# Altium schematic sheet FPGA_Memec_Spartan3_SxLC_Rev1.SchDoc: Example for Memec Spartan3 SxLC Rev1
size B; SheetNumber: 1; SheetTotal: 1; Address1: L3, 12a Rodborough Rd; Address2: Frenchs Forest; Address3: NSW; Address4: Australia 2086; Organization: Altium Limited
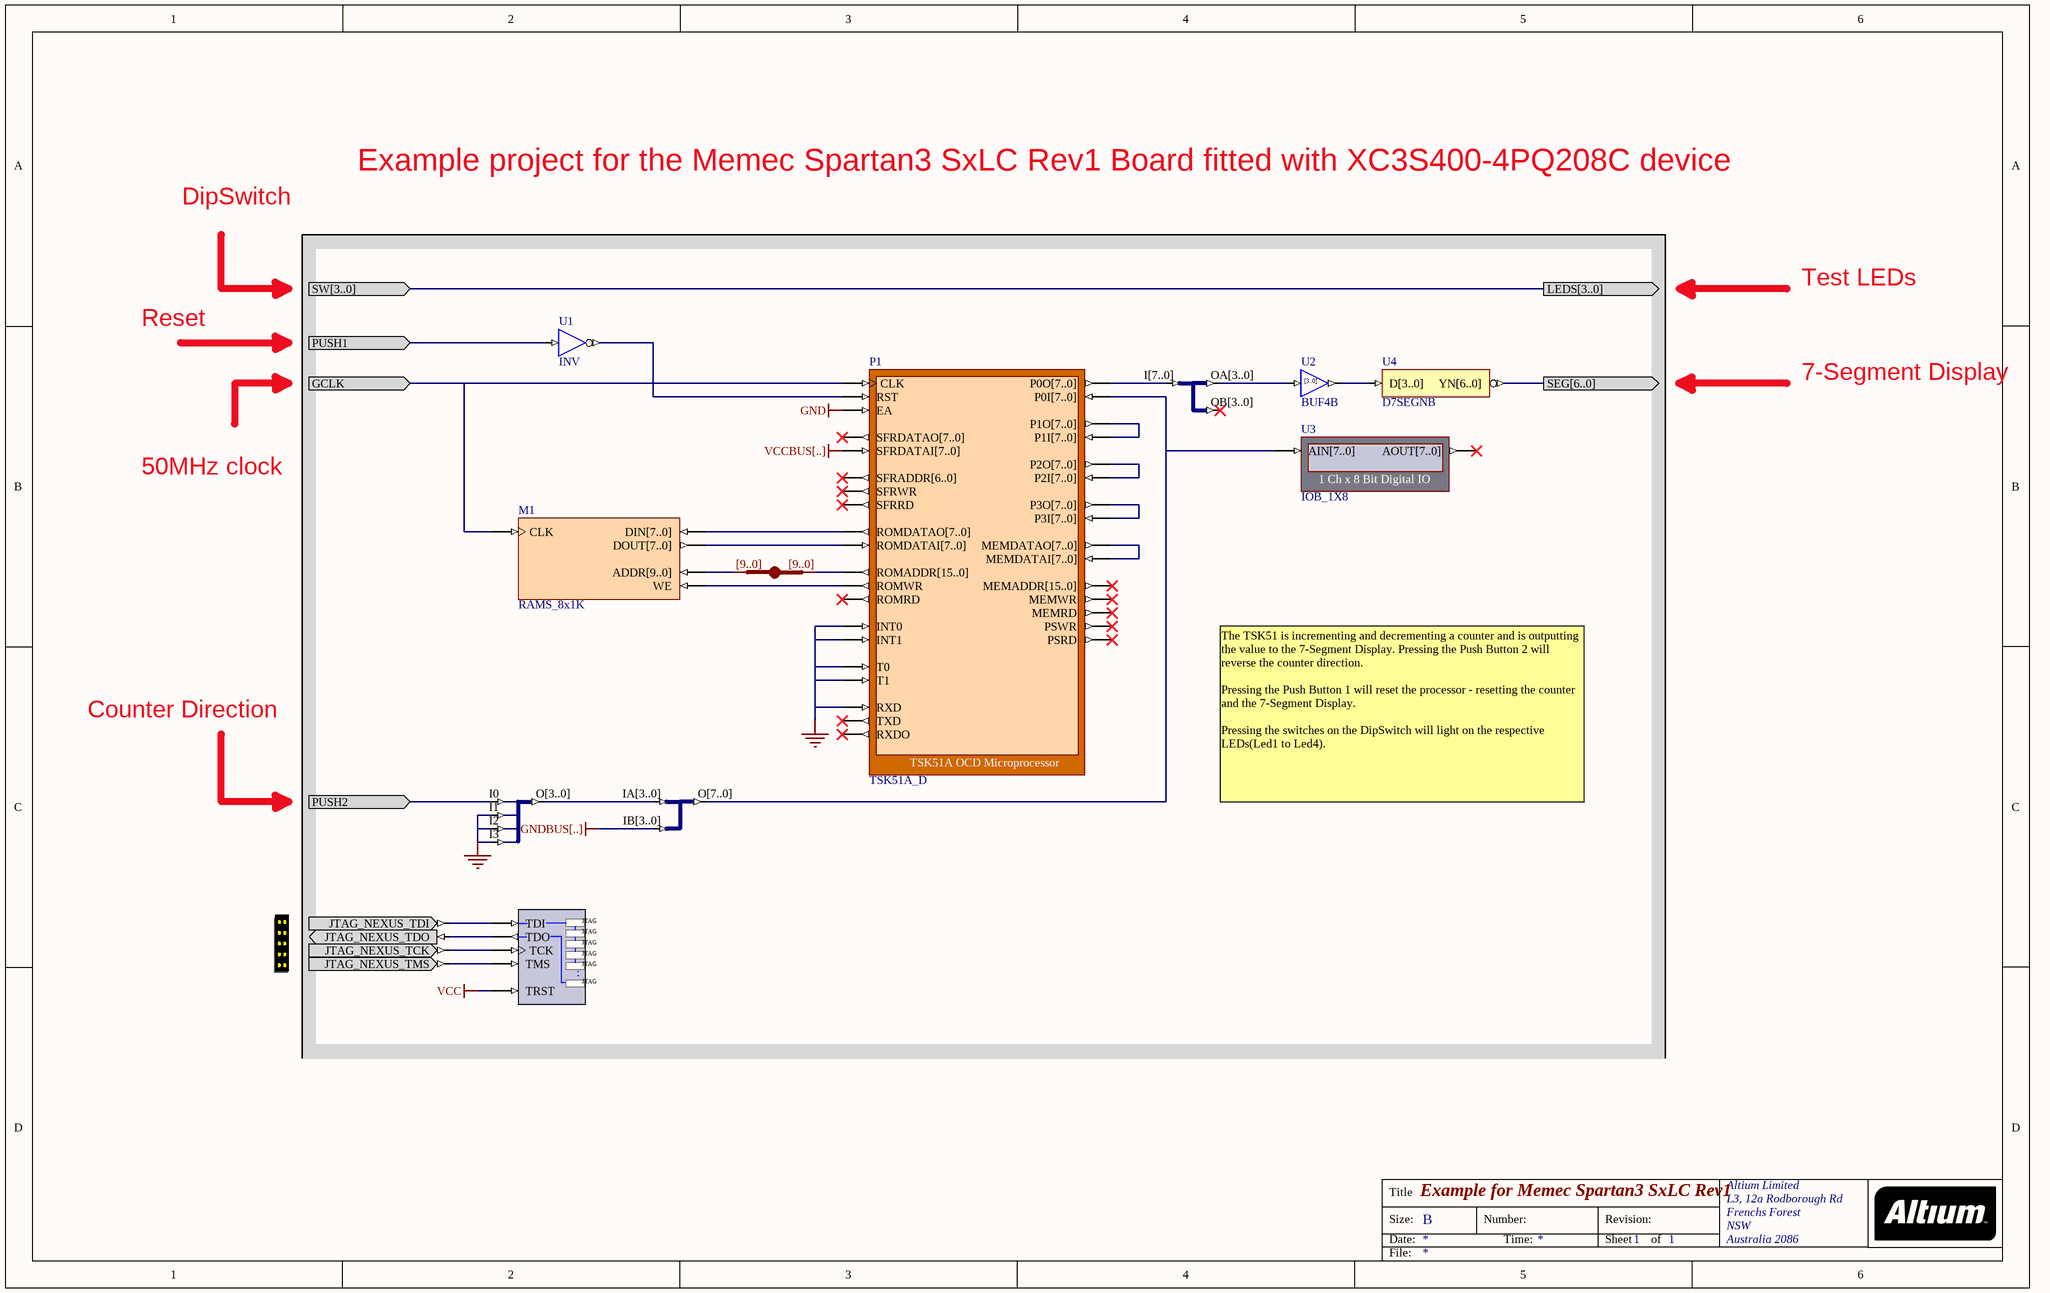
[diagram p0: FPGA_Memec_Spartan3_SxLC_Rev1.SchDoc]

## Parts
?  NEXUS_JTAG_CONNECTOR  (value not drawn)
JB_S1  IndexA: [9..0]  (hidden comment: JB)
M1  RAMS_8x1K
NEXUS_JTAG_PORT  NEXUS_JTAG_PORT  (value not drawn)
P1  TSK51A_D
U1  INV
U2  BUF4B
U3  IOB_1X8
U4  D7SEGNB
U5  J8B_4B2  (value not drawn)
U6  J4S_4B  (value not drawn)
U7  J4B2_8B  (value not drawn)

## Ports
GCLK (in), LEDS[3..0] (out), PUSH1 (in), PUSH2 (in), SEG[6..0] (out), SW[3..0] (in)

## Nets
GND: P1.EA P1.INT0 P1.INT1 P1.RXD P1.T0 P1.T1 U6.I1 U6.I2 U6.I3
GNDBUS[..]: U7.IB[3..0]
VCC: NEXUS_JTAG_PORT.TRST
VCCBUS[..]: P1.SFRDATAI[7..0]
GCLK: M1.CLK P1.CLK ; port GCLK
PUSH1: U1.I ; port PUSH1
PUSH2: U6.I0 ; port PUSH2
SEG[6..0]: U4.YN[6..0] ; port SEG[6..0]
Net?_JTAG_NEXUS_TCK: ?.JTAG_NEXUS_TCK NEXUS_JTAG_PORT.TCK
Net?_JTAG_NEXUS_TDI: ?.JTAG_NEXUS_TDI NEXUS_JTAG_PORT.TDI
Net?_JTAG_NEXUS_TDO: ?.JTAG_NEXUS_TDO NEXUS_JTAG_PORT.TDO
Net?_JTAG_NEXUS_TMS: ?.JTAG_NEXUS_TMS NEXUS_JTAG_PORT.TMS
NetJB_S1_A[0..0]: JB_S1.A[0..0] M1.ADDR[9..0]
NetJB_S1_B[0..0]: JB_S1.B[0..0] P1.ROMADDR[15..0]
NetM1_DIN[7..0]: M1.DIN[7..0] P1.ROMDATAO[7..0]
NetM1_DOUT[7..0]: M1.DOUT[7..0] P1.ROMDATAI[7..0]
NetM1_WE: M1.WE P1.ROMWR
NetP1_MEMDATAI[7..0]: P1.MEMDATAI[7..0] P1.MEMDATAO[7..0]
NetP1_P0I[7..0]: P1.P0I[7..0] U3.AIN[7..0] U7.O[7..0]
NetP1_P0O[7..0]: P1.P0O[7..0] U5.I[7..0]
NetP1_P1I[7..0]: P1.P1I[7..0] P1.P1O[7..0]
NetP1_P2I[7..0]: P1.P2I[7..0] P1.P2O[7..0]
NetP1_P3I[7..0]: P1.P3I[7..0] P1.P3O[7..0]
NetP1_RST: P1.RST U1.O
NetU2_I[3..0]: U2.I[3..0] U5.OA[3..0]
NetU2_O[3..0]: U2.O[3..0] U4.D[3..0]
NetU6_O[3..0]: U6.O[3..0] U7.IA[3..0]

Not connected (* = marked no-connect by the designer): P1 MEMADDR[15..0]* MEMRD* MEMWR* PSRD* PSWR* ROMRD* RXDO* SFRADDR[6..0]* SFRDATAO[7..0]* SFRRD* SFRWR* TXD*; U3 AOUT[7..0]*; U5 OB[3..0]*

## Buses and harness runs
bus port LEDS[3..0] = port SW[3..0]

## Notes on the sheet
- DipSwitch
- Example project for the Memec Spartan3 SxLC Rev1 Board fitted with XC3S400-4PQ208C device
- Reset
- Test LEDs
- 50MHz clock
- 7-Segment Display
- Counter Direction
- The TSK51 is incrementing and decrementing a counter and is outputting the value to the 7-Segment Display. Pressing the Push Button 2 will reverse the counter direction.
  Pressing the Push Button 1 will reset the processor - resetting the counter and the 7-Segment Display.
  Pressing the switches on the DipSwitch will light on the respective LEDs(Led1 to Led4).
- Title
- Size:
- Date:
- B
- Number:
- Time:
- Revision:
- Sheet
- of
- File:
- (in symbol BUF4B) [3..0]
- (in symbol NEXUS_JTAG_PORT) JTAG; .

## Library data of the parts
? = NEXUS_JTAG_CONNECTOR: JTAG Port; PortComponent: True; Published: 19-Nov-2003; Publisher: Altium Limited
JB_S1 = JB: System BUS Joiner; Published: 29-Jan-2004; Publisher: Altium Limited; LastRevisionNo: 1.00.00; HelpURL: CR0118 FPGA Generic Library Guide.pdf#page=296; FunctionalClass: Bus Joiner; IndexB: [9..0]
M1 = RAMS_8x1K: Single Port RAM; Memory_Depth: 1024; Memory_Type: RAM_SinglePortBlock; Memory_Width: 8; Memory_ClockEdge: Rising; Nexus_Core: Memory_Program; Memory_EnablePin: False; Published: 11/10/2004; Publisher: Altium Hobart Technology Center; Memory_ByteWrites: False
NEXUS_JTAG_PORT = NEXUS_JTAG_PORT: Nexus Processor JTAG Chain Connector; NEXUS_JTAG_CONNECTOR: True; Published: 18-Nov-2003; Publisher: Altium Limited
P1 = TSK51A_D: TSK51A OCD Microprocessor; NEXUS_CORE: Processor_OCDS; NEXUS_JTAG_DEVICE: True; NEXUS_JTAG_ORDER: 0; ChildModel1: RAM256x8_TSK51D; ChildCore1: M1; Published: 18/12/2003; Publisher: Altium Hobart Technology Centre; Core Revision: 1.00.00
U1 = INV: Inverter; FunctionalClass: Logic Primitive; ArchiveName: GENERIC; VHDLIB_SIM: GENERIC_LIB; Published: 29-Jan-2004; Publisher: Altium Limited; XilinxEquivalent: INV; LastRevisionNo: 1.00.00; HelpURL: CR0118 FPGA Generic Library Guide.pdf#page=290; SubClass: INV
U2 = BUF4B: 4-Bit General Purpose (Non-inverting) Buffer, Bus Version; SubClass: BUF; |PortSize: 4; ArchiveName: GENERIC; VHDLIB_SIM: GENERIC_LIB; Published: 29-Jan-2004; Publisher: Altium Limited; LastRevisionNo: 1.00.00; HelpURL: CR0118 FPGA Generic Library Guide.pdf#page=121; FunctionalClass: Buffer; PortSize: 4; PortStyle: Bus Version
U3 = IOB_1X8: 1 Ch x 8 Bit Digital IO; NEXUS_CORE: Instrument; NEXUS_JTAG_DEVICE: True; NEXUS_JTAG_ORDER: 0; Published: 30/09/2003; Publisher: Altium Hobart Technology Centre; Core Revision: 1.00.00
U4 = D7SEGNB: 7-Segment-Display Decoder for Common-Anode LED (Active Low Output), Bus Version; SubClass: 7SEGN; PortSize: 7; ArchiveName: GENERIC; VHDLIB_SIM: GENERIC_LIB; Published: 29-Jan-2004; Publisher: Altium Limited; LastRevisionNo: 1.00.00; HelpURL: CR0118 FPGA Generic Library Guide.pdf#page=162; FunctionalClass: Decoder; PortStyle: Bus Version
U5 = J8B_4B2: 1 x 8-bit input bus to 2 x 4-Bit output bus; FunctionalClass: Bus Joiner; PortSize: 8; ArchiveName: GENERIC; VHDLIB_SIM: GENERIC_LIB; Published: 29-Jan-2004; Publisher: Altium Limited; LastRevisionNo: 1.00.00; HelpURL: CR0118 FPGA Generic Library Guide.pdf#page=297
U6 = J4S_4B: 4 Single pin inputs to single 4-Bit output bus; FunctionalClass: Bus Joiner; PortSize: 4; ArchiveName: GENERIC; VHDLIB_SIM: GENERIC_LIB; Published: 29-Jan-2004; Publisher: Altium Limited; LastRevisionNo: 1.00.00; HelpURL: CR0118 FPGA Generic Library Guide.pdf#page=305
U7 = J4B2_8B: 2 x 4-Bit input bus to 1 x 8-bit output bus; FunctionalClass: Bus Joiner; PortSize: 4; ArchiveName: GENERIC; VHDLIB_SIM: GENERIC_LIB; Published: 29-Jan-2004; Publisher: Altium Limited; LastRevisionNo: 1.00.00; HelpURL: CR0118 FPGA Generic Library Guide.pdf#page=301